# EAGLE design USB_Board (EAGLE 6.2)
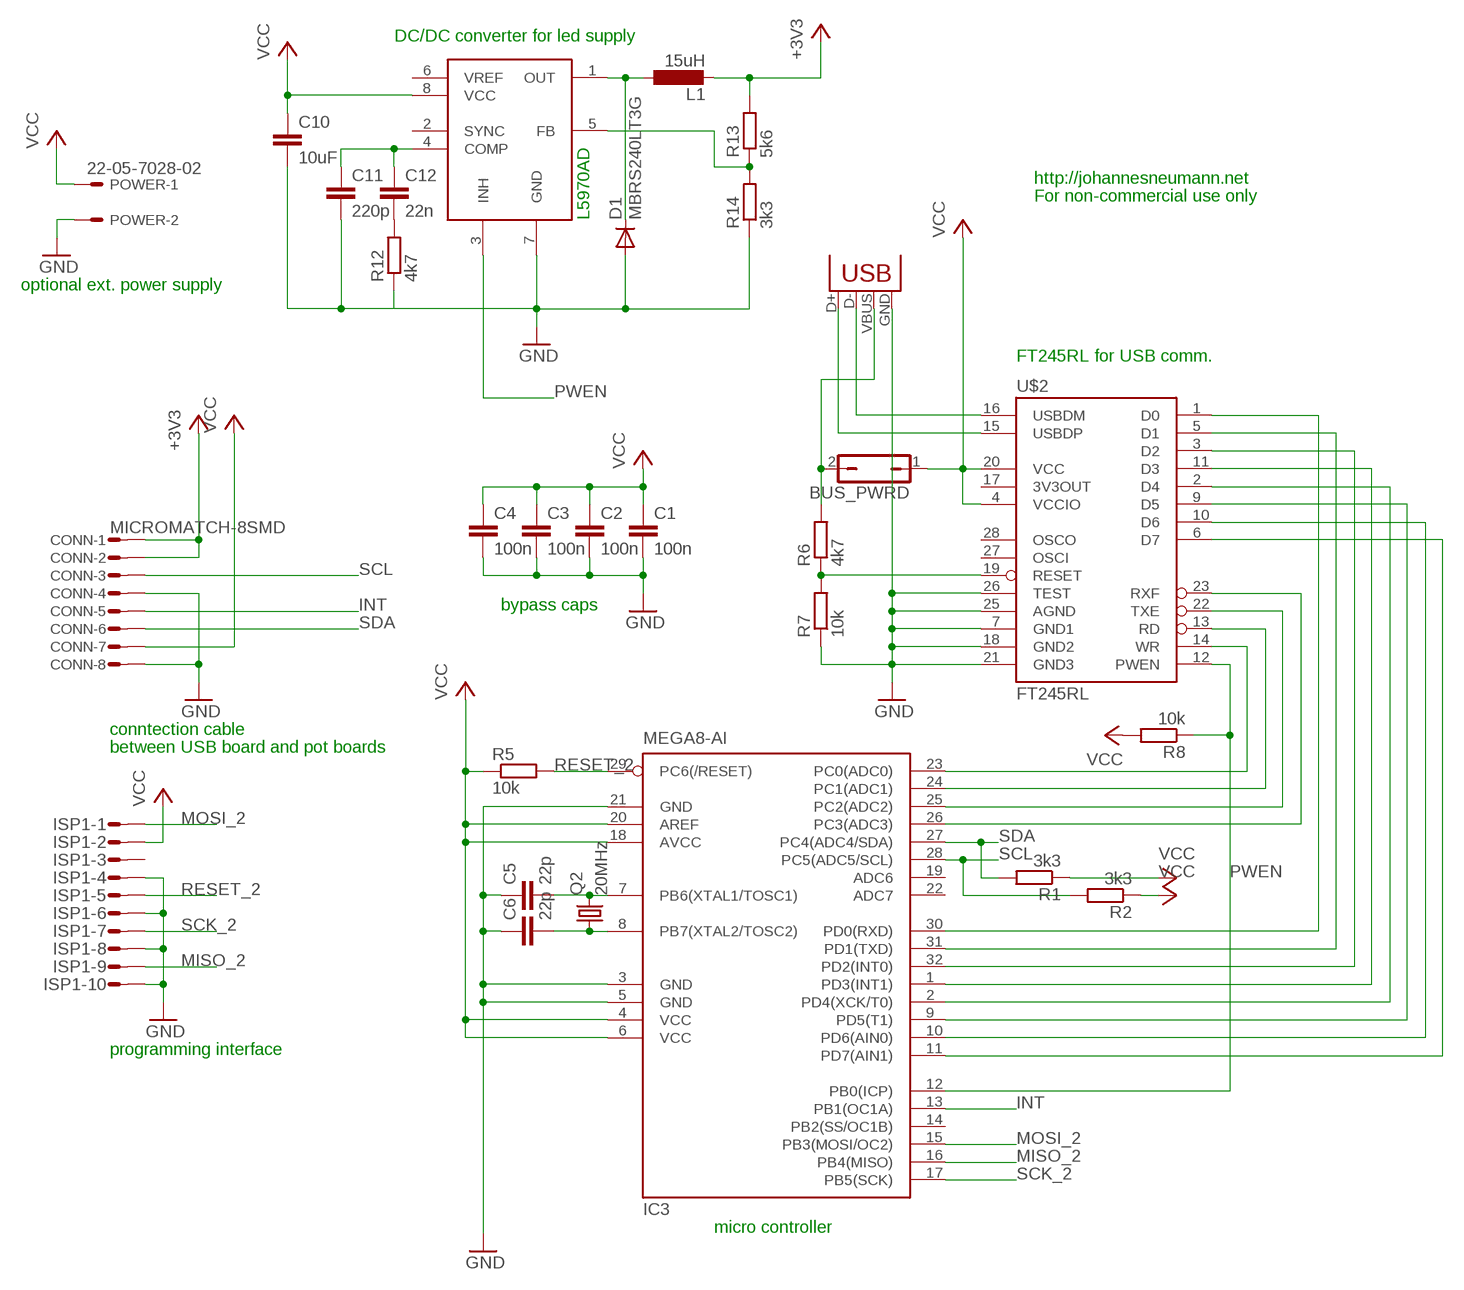
[diagram p0: schematic, sheet 1]

## Parts
BUS_PWRD  JP1Q  [JP1]
C1  100n  C-EUC0603  [C0603]
C2  100n  C-EUC0603  [C0603]
C3  100n  C-EUC0603  [C0603]
C4  100n  C-EUC0603  [C0603]
C5  22p  C-EUC0603  [C0603]
C6  22p  C-EUC0603  [C0603]
C10  10uF  C-EUC0805  [C0805]
C11  220p  C-EUC0603  [C0603]
C12  22n  C-EUC0603  [C0603]
CONN  MICROMATCH-8SMD  [MICROMATCH-8-SMD]
D1  MBRS240LT3G  1N4004  [DO41-10]
IC3  MEGA8-AI  [TQFP32-08]
ISP1  MICROMATCH-10-SMD  [MICROMATCH-10-SMD]
L1  15uH  L-EUPIS2816  [PIS2816]
POWER  22-05-7028-02  [7395-02]
Q2  20MHz  CRYSTALSM49  [SM49]
R1  3k3  R-EU_R0603  [R0603]
R2  3k3  R-EU_R0603  [R0603]
R5  10k  R-EU_R0603  [R0603]
R6  4k7  R-EU_R0603  [R0603]
R7  10k  R-EU_R0603  [R0603]
R8  10k  R-EU_R0603  [R0603]
R12  4k7  R-EU_R0603  [R0603]
R13  5k6  R-EU_R0603  [R0603]
R14  3k3  R-EU_R0603  [R0603]
U$2  FT245RL  [SSOP28DB]
U$3  L5970AD  [SO8]
X1  USBPTH  [USB-B-PTH]

## Nets
+3V3: CONN.1 CONN.2 L1.2 R13.2
GND: C1.2 C2.2 C3.2 C4.2 C5.1 C6.1 C10.2 C11.2 CONN.4 CONN.8 D1.A IC3.3(GND) IC3.5(GND) IC3.21(GND) ISP1.P$4 ISP1.P$6 ISP1.P$8 ISP1.P$10 POWER.2 R7.1 R12.1 R14.1 U$2.7(GND1) U$2.18(GND2) U$2.21(GND3) U$2.25(AGND) U$2.26(TEST) U$3.7(GND) X1.GND
INT: CONN.5 IC3.13(PB1(OC1A))
MISO_2: IC3.16(PB4(MISO)) ISP1.P$9
MOSI_2: IC3.15(PB3(MOSI/OC2)) ISP1.P$1
N$3: C5.2 IC3.7(PB6(XTAL1/TOSC1)) Q2.2
N$4: C6.2 IC3.8(PB7(XTAL2/TOSC2)) Q2.1
N$5: U$2.16(USBDM) X1.D-
N$7: IC3.30(PD0(RXD)) U$2.1(D0)
N$8: IC3.31(PD1(TXD)) U$2.5(D1)
N$9: IC3.32(PD2(INT0)) U$2.3(D2)
N$10: IC3.1(PD3(INT1)) U$2.11(D3)
N$11: IC3.2(PD4(XCK/T0)) U$2.2(D4)
N$12: IC3.9(PD5(T1)) U$2.9(D5)
N$13: IC3.10(PD6(AIN0)) U$2.10(D6)
N$14: IC3.11(PD7(AIN1)) U$2.6(D7)
N$15: IC3.26(PC3(ADC3)) U$2.23(RXF)
N$16: IC3.25(PC2(ADC2)) U$2.22(TXE)
N$17: IC3.24(PC1(ADC1)) U$2.13(RD)
N$18: IC3.23(PC0(ADC0)) U$2.14(WR)
N$19: D1.C L1.1 U$3.1(OUT)
N$21: BUS_PWRD.2 R6.2 X1.VBUS
N$29: R13.1 R14.2 U$3.5(FB)
N$33: C12.2 R12.2
N$34: C11.1 C12.1 U$3.4(COMP)
PWEN: IC3.12(PB0(ICP)) R8.1 U$2.12(PWEN) U$3.3(INH)
PWR_ON: R6.1 R7.2 U$2.19(RESET)
RESET_2: IC3.29(PC6(/RESET)) ISP1.P$5 R5.2
SCK_2: IC3.17(PB5(SCK)) ISP1.P$7
SCL: CONN.3 IC3.28(PC5(ADC5/SCL)) R2.2
SDA: CONN.6 IC3.27(PC4(ADC4/SDA)) R1.2
USB: U$2.15(USBDP) X1.D+
VCC: BUS_PWRD.1 C1.1 C2.1 C3.1 C4.1 C10.1 CONN.7 IC3.4(VCC) IC3.6(VCC) IC3.18(AVCC) IC3.20(AREF) ISP1.P$2 POWER.1 R1.1 R2.1 R5.1 R8.2 U$2.4(VCCIO) U$2.20(VCC) U$3.8(VCC)
Unconnected: IC3.14(PB2(SS/OC1B)) IC3.19(ADC6) IC3.22(ADC7) ISP1.P$3 U$2.17(3V3OUT) U$2.27(OSCI) U$2.28(OSCO) U$3.2(SYNC) U$3.6(VREF)

## Notes on the sheet
- DC/DC converter for led supply
- http://johannesneumann.net
- For non-commercial use only
- L5970AD
- optional ext. power supply
- FT245RL for USB comm.
- bypass caps
- conntection cable
- between USB board and pot boards
- programming interface
- micro controller

## Library data of the parts
BUS_PWRD = jumper:JP1Q: JUMPER
C1-C6 C10-C12 = rcl:C-EU: CAPACITOR, European symbol
CONN = con-amp-micromatch-2:MICROMATCH-8: MicroMaTch 8 7-215464-8 / 0-215464-8 Drawing Number C-215464 DDEController.pdf
D1 = diode:1N4004: DIODE general purpose rectifier, 1 A
IC3 = atmel:MEGA8: MICROCONTROLLER 8 Kbytes FLASH, 1 kbytes SRAM, 512 bytes EEPROM, USART, 6-channel 10 bit ADC, 2-channel 8 bit ADC Pin compatible with Atmega48, ATMega88, ATMega168 Source: avr.lbr
ISP1 = con-amp-micromatch:MICROMATCH-10-SMD
L1 = rcl:L-EU: INDUCTOR, European symbol
POWER = con-molex:22-?-02: CONNECTOR wire to board 2.54 mm (.1 inch) pitch header
Q2 = crystal:CRYSTAL: CRYSTAL
R1 R2 R5-R8 R12-R14 = rcl:R-EU_: RESISTOR, European symbol
U$2 = SparkFun:FT245RL: USB FIFO Controller 4th Generation USB Controller (USB <-> Parallel) - FIFO. Spark Fun Electronics SKU : COM-00787
U$3 = johannes:L5970AD
X1 = SparkFun:USB: USB Connectors USB-B-PTH is fully proven SKU : PRT-00139 USB-miniB is fully proven SKU : PRT-00587 USB-A-PCB is untested. USB-A-H is throughly reviewed, but untested. Spark Fun Electronics SKU : PRT-00437 USB-B-SMT is throughly reviewed, but untested. Needs silkscreen touching up. USB-A-S has not been used/tested USB-MB-H has not been used/tested

## Board
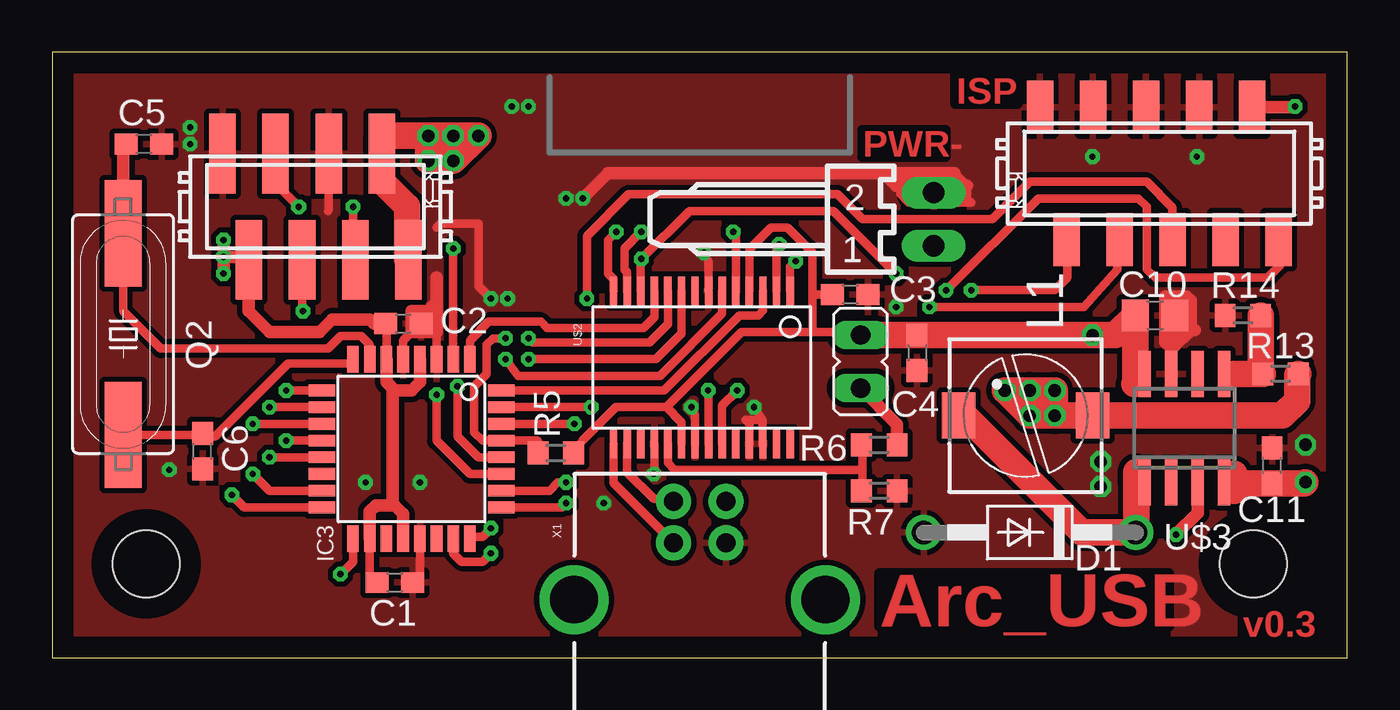
[diagram p1: board, top side]
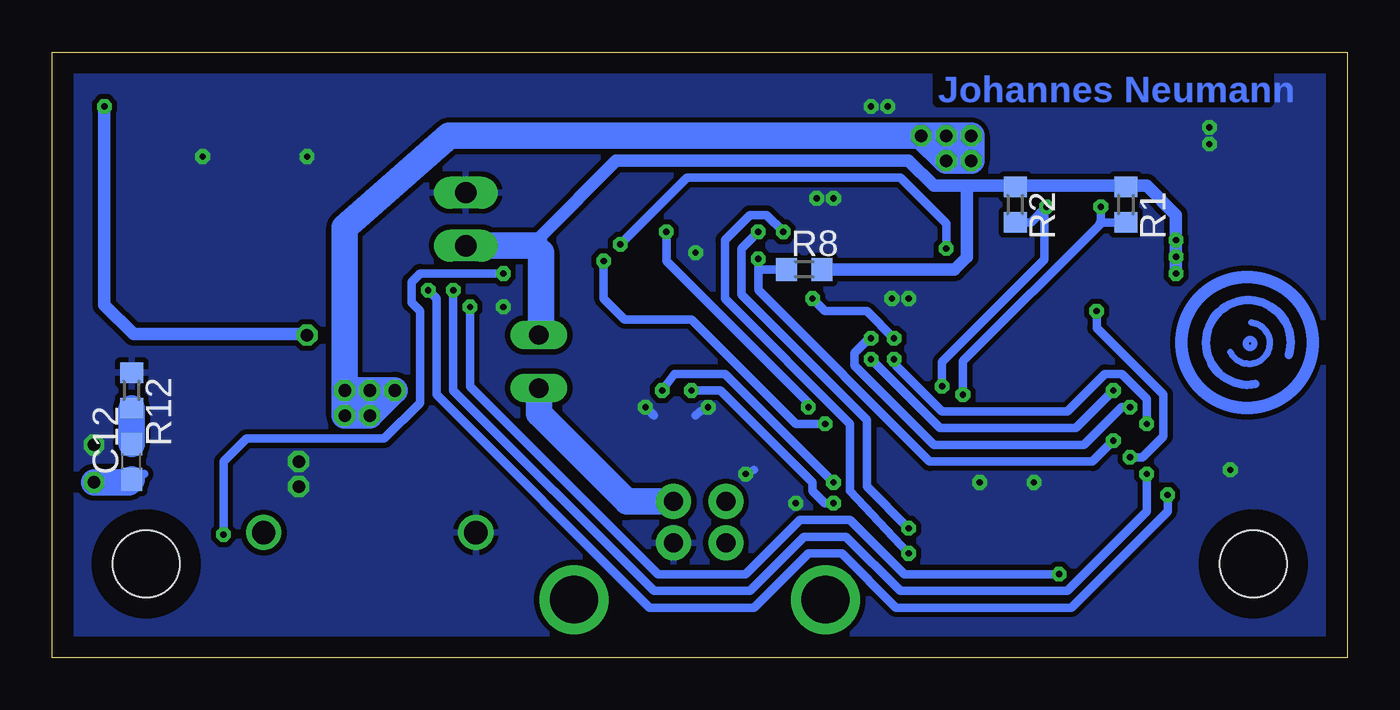
[diagram p2: board, bottom side, seen from below]

Size 62 x 29 mm. Coordinates in mm from the lower left corner, seen from the top.
Outline: 0,0 62,0 62,29 0,29 0,0
Copper layers (1*16): Top 0.035mm / dielectric 1.5mm / Bottom 0.035mm
Design rules: minimum track width 0.2mm, minimum drill 0.3mm, track to track 0.2mm, track to pad 0.2mm, pad to pad 0.2mm, via to via 0.2mm, smd to smd 0.15mm, copper to edge 40mil, drill to drill 8mil, minimum pad ring 0.2mm, minimum via ring 0.2mm, stop-mask expansion 0.15mm, vias tented up to drill 0.6mm, thermal gap 10mil
Holes 3.2 mm at 4.5,4.5 57.5,4.5

### Footprints (pad centres in the part's own frame; a part is rotated, then mirrored left to right if it is on the bottom)
JP1 = drill 0.914 long: 1 0,-1.27; 2 0,1.27
C0603 = smd 1.1 x 1: 1 -0.85,0; 2 0.85,0
C0805 = smd 1.3 x 1.5: 1 -0.95,0; 2 0.95,0
MICROMATCH-8-SMD = smd 1.27 x 3.81: 1 4.445,-2.54; 2 3.175,2.54; 3 1.905,-2.54; 4 0.635,2.54; 5 -0.635,-2.54; 6 -1.905,2.54; 7 -3.175,-2.54; 8 -4.445,2.54
DO41-10 = drill 1.118: A 5.08,0; C -5.08,0
TQFP32-08 = smd 1.27 x 0.559: 1 -4.293,2.8; 2 -4.293,2; 3 -4.293,1.2; 4 -4.293,0.4; 5 -4.293,-0.4; 6 -4.293,-1.2; 7 -4.293,-2; 8 -4.293,-2.8; 17 4.293,-2.8; 18 4.293,-2; 19 4.293,-1.2; 20 4.293,-0.4; 21 4.293,0.4; 22 4.293,1.2; 23 4.293,2; 24 4.293,2.8 | smd 0.559 x 1.27: 9 -2.8,-4.293; 10 -2,-4.293; 11 -1.2,-4.293; 12 -0.4,-4.293; 13 0.4,-4.293; 14 1.2,-4.293; 15 2,-4.293; 16 2.8,-4.293; 25 2.8,4.293; 26 2,4.293; 27 1.2,4.293; 28 0.4,4.293; 29 -0.4,4.293; 30 -1.2,4.293; 31 -2,4.293; 32 -2.8,4.293
MICROMATCH-10-SMD = smd 1.27 x 2.54: P$1 -5.715,3.175; P$2 -4.445,-3.175; P$3 -3.175,3.175; P$4 -1.905,-3.175; P$5 -0.635,3.175; P$6 0.635,-3.175; P$7 1.905,3.175; P$8 3.175,-3.175; P$9 4.445,3.175; P$10 5.715,-3.175
PIS2816 = smd 2.2 x 1.6: 1 0,3.2; 2 0,-3.2
7395-02 = drill 1.016 long: 1 1.27,0; 2 -1.27,0
SM49 = smd 5.08 x 1.778: 1 -4.826,0; 2 4.826,0
R0603 = smd 1 x 1.1: 1 -0.85,0; 2 0.85,0
SSOP28DB = smd 0.348 x 1.397: 1 -4.225,-3.656; 2 -3.575,-3.656; 3 -2.925,-3.656; 4 -2.275,-3.656; 5 -1.625,-3.656; 6 -0.975,-3.656; 7 -0.325,-3.656; 8 0.325,-3.656; 9 0.975,-3.656; 10 1.625,-3.656; 11 2.275,-3.656; 12 2.925,-3.656; 13 3.575,-3.656; 14 4.225,-3.656; 15 4.225,3.656; 16 3.575,3.656; 17 2.925,3.656; 18 2.275,3.656; 19 1.625,3.656; 20 0.975,3.656; 21 0.325,3.656; 22 -0.325,3.656; 23 -0.975,3.656; 24 -1.625,3.656; 25 -2.275,3.656; 26 -2.925,3.656; 27 -3.575,3.656; 28 -4.225,3.656
SO8 = smd 0.6 x 2.2: 1 -1.905,-2.6; 2 -0.635,-2.6; 3 0.635,-2.6; 4 1.905,-2.6; 5 1.905,2.6; 6 0.635,2.6; 7 -0.635,2.6; 8 -1.905,2.6
USB-B-PTH = drill 0.914 pad 1.676: D+ 0,1.25; D- 1.981,1.25; GND 0,-1.25; VBUS 1.981,-1.25 | drill 2.286: S1 -2.718,-6.02; S2 -2.718,6.02

### Placement (x,y rotation side)
BUS_PWRD  38.7,14.18 180 top
C1  16.4,3.6 0 top
C2  16.8,16 0 top
C3  38.2,17.4 0 top
C4  41.4,14.6 270 top
C5  4.4,24.6 180 top
C6  7.2,9.9 90 top
C10  52.8,16.4 0 top
C11  58.4,9.2 90 top
C12  58.2,9.4 90 bottom
CONN  12.6,21.6 0 top
D1  46.8,6 180 top
IC3  17.2,10 270 top
ISP1  53,23.2 180 top
L1  46.6,11.6 90 top
POWER  42.2,21 270 top
Q2  3.4,15.5 90 top
R1  10.6,21.7 270 bottom
R2  15.9,21.7 270 bottom
R5  24.1,9.8 180 top
R6  39.6,10.2 0 top
R7  39.6,8 180 top
R8  26,18.6 0 bottom
R12  58.2,12.8 270 bottom
R13  58.8,13.6 0 top
R14  57,16.4 0 top
U$2  31.1,13.9 180 top
U$3  54.2,11 0 top
X1  31,5.5 90 top

### Tracks (layer width: path | path; a pad name or v marks a point on that pad's centre or on a via)
+3V3  (via drill 0.6)
  Top 1.27: R13.2 59.6,13.55 59.6,12.3 58.9,11.6 L1.2 v46.8,11.6 v45.6,12.8 v46.8,12.8 v48,12.8 v48,11.6 | CONN.1 17,19.11 17,21.6 15.78,22.82 CONN.2 15.78,24.98 15.8,25 v18,25 | v18,25 v19.2,25 v20.4,25 v19.2,23.8 v18,23.8 v18,25
  Bottom 1.27: v48,12.8 v48,11.6 v46.8,11.6 v45.6,12.8 v48,12.8 | 18,24.4 v18,23.8 v19.2,23.8 v20.4,25 | v20.4,25 43,25 48,20.6 v48,12.8 | v20.4,25 v19.2,25 v18,25 18,24.6
GND  (via drill 0.3, 0.6)
  Top 0.406: U$2.7 31.43,18.98 31.4,19 | CONN.4 13.23,21.43 13.2,21.4 | IC3.5 16.8,15.2 17.2,15.6 17.6,15.6 | 17.6,15.6 18.2,15.6 18.4,15.4 IC3.3 | C2.2 17.65,15.65 17.6,15.6 | U$2.18 28.82,9.03 v28.8,8.8 | U$2.21 30.77,11.62 v30.6,12 | U$2.25 33.38,11.22 33.2,11.4 34,11.4 | 34,11.4 34,10.2 | 34,11.4 v33.6,12 | IC3.21 17.6,3.95 C1.2 | 18.4,20.6 18.6,20.8 20.4,20.8 20.4,17.8 v21,17.2 | 43.2,23.2 43.8,22.6 43.8,22 44,21.8 41,21.8 40.6,22.2 40.6,22.6 41,23 42.6,23 42.6,22.6
  Top 0.61: U$3.7 53.56,16.21 C10.2 53.75,16.35 54.3,15.8 | 54.7,15.7 54.5,15.7 53.7,14.9 53.7,15.2 54.3,15.8 | 54.3,15.8 54.5,16 54.5,17.1 54.3,17.3 53.3,17.3 53.3,15.1 53.5,14.9 | C2.2 17.65,16.25 | 18.4,17 18.4,15.6 18.2,15.6 17.2,15.6 17.2,16.6 17.8,16.6 17.8,16.4 18.4,17 | 18.4,18.2 18.4,17 | 43.13,23.2 40,23.2 | 43.2,23.2 43.13,23.2 | 43.13,23.2 POWER.2 | 40,23.2 39.8,23.2 | 39.8,23.2 26.6,23.2 v25.4,22 | 40.6,22.6 40,23.2 | 43.8,22.6 40.4,22.6 39.8,23.2
  Bottom 0.406: v28.8,8.8 28.4,9 | v30.6,12 31,11.8 31.2,11.6 | v33.6,12 33.2,11.6
  other vias: 60,10.2 50.2,9.4 50.2,8.2 31.2,19.4 24.6,22 21.8,17.2 40.4,16.8 22,26.4 22.8,26.4 49.8,24 54.8,24 6.6,25.4 6.6,24.6 5.6,9 15,8.4 17.6,8.4 26.4,7.4
  pour Top (isolate 0.254): 0,0 62,0 62,29 0,29
  pour Bottom (isolate 0.254): 0,29 62,29 62,-0.4 0,-0.4
INT  (via drill 0.3)
  Top 0.406: IC3.13 v10.4,9.6 | CONN.5 11.96,16.43 v12,16.6
  Bottom 0.406: v10.4,9.6 9.8,9.6 8.8,10.6 8.8,12.6 12,15.8 v12,16.6
MISO_2  (via drill 0.3)
  Top 0.406: IC3.16 9.2,7.2 v8.6,7.8 | v44,17.6 48,17.6 48.6,18.2 48.6,19.98 ISP1.P$9
  Bottom 0.406: v8.6,7.8 8.6,7 13.2,2.4 21.6,2.4 24.2,5 25.8,5 28.4,2.4 33.4,2.4 43.6,12.6 43.6,17.2 v44,17.6
MOSI_2  (via drill 0.3)
  Top 0.406: IC3.15 10.4,8 v9.6,8.8 | v42.8,17.6 47.2,22 52,22 52.4,21.6 52.4,18.6 52.8,18.2 58.2,18.2 58.8,18.8 58.8,19.94 ISP1.P$1 58.8,20.11
  Bottom 0.406: v9.6,8.8 9.6,7 13.4,3.2 21.4,3.2 24,5.8 26,5.8 28.6,3.2 33.2,3.2 42.8,12.8 v42.8,17.6
N$3
  Top 0.406: IC3.7 15.2,15 14.8,15.4 13.8,15.4 13.2,14.8 5.2,14.8 3.4,16.6 Q2.2
  Top 0.61: C5.2 3.4,24.55 Q2.2 3.3,20.23
N$4
  Top 0.406: Q2.1 7.12,10.67 | C6.2 7.35,10.6 7.8,10.6 11.29,14.09 14.2,14.09 IC3.8
  Top 0.61: 7.12,10.67 C6.2
N$5
  Top 0.406: U$2.16 27.52,8.88 28.8,7.6 29.63,7.6 X1.D-
N$7  (via drill 0.3)
  Top 0.406: IC3.30 v25,11.2 | 35.4,18.8 v35.6,19 35.33,18.73 U$2.1
  Bottom 0.406: v25,11.2 26.4,11.2 31.4,16.2 34.6,16.2 35.6,17.2 v35.6,19
N$8  (via drill 0.3)
  Top 0.406: IC3.31 v25.8,12 | U$2.5 32.73,20.27 v32.6,20.4
  Bottom 0.406: v25.8,12 25.8,12.2 32.6,19 v32.6,20.4
N$9
  Top 0.406: IC3.32 29.3,12.8 32.9,16.4 33.8,16.4 34.02,16.62 U$2.3
N$10
  Top 0.406: U$2.11 28.82,16.32 28.3,15.8 23.7,15.8 23.4,16.1 20.9,16.1 20,15.2 IC3.1
N$11  (via drill 0.3)
  Top 0.406: U$2.2 34.67,19.68 v34.8,19.8 | v19.2,19.6 IC3.2
  Bottom 0.406: v34.8,19.8 31.6,23 21.4,23 19.2,20.8 v19.2,19.6
N$12  (via drill 0.3)
  Top 0.406: U$2.9 30.12,15.53 28.9,14.3 v22.8,14.3 | v11.2,12.8 IC3.9
  Bottom 0.406: v11.2,12.8 13,11 19.5,11 v22.8,14.3
N$13  (via drill 0.3)
  Top 0.406: U$2.10 29.48,15.97 28.6,15.1 23,15.1 v22.8,15.3 | v10.4,12 IC3.10
  Bottom 0.406: v22.8,15.3 22.9,15.3 23.6,14.6 23.6,14 19.8,10.2 12.6,10.2 10.8,12 v10.4,12
N$14  (via drill 0.3)
  Top 0.406: U$2.6 32.08,16.48 29.1,13.5 22.3,13.5 v21.7,14.3 | IC3.11 v9.6,11.2
  Bottom 0.406: v9.6,11.2 9.6,12.4 10.8,13.6 11.6,13.6 13.4,11.8 19.4,11.8 21.6,14 21.6,14.2 v21.7,14.3
N$15  (via drill 0.3)
  Top 0.406: U$2.23 32.08,12.07 v32.8,12.8 | IC3.26 23.8,8 24.2,8.4 v24.6,8.4
  Bottom 0.406: v24.6,8.4 29.8,13.6 32.2,13.6 v32.8,12.8
N$16  (via drill 0.3)
  Top 0.406: U$2.22 31.43,12.62 v31.4,12.8 | IC3.25 24.4,7.2 v24.6,7.4
  Bottom 0.406: v31.4,12.8 30,12.8 25.6,8.4 25.6,8 25,7.4 v24.6,7.4
N$17  (via drill 0.3)
  Top 0.406: v28.2,20.4 27.4,19.6 27.4,18.6 27.52,18.48 U$2.13 | v21,6.2 20.6,5.8 20.09,5.8 IC3.24
  Bottom 0.406: v28.2,20.4 29,19.6 29,17.4 23,11.4 23,8.2 v21,6.2
N$18  (via drill 0.3)
  Top 0.406: 26.88,20.32 v27,20.4 26.6,20 26.6,18.4 26.88,18.12 U$2.14 | IC3.23 19.2,5 19.6,4.6 20.6,4.6 v21,5
  Bottom 0.406: v27,20.4 27.8,21.2 28.6,21.2 29.8,20 29.8,17.2 23.8,11.2 23.8,8 v21,5
N$19
  Top 0.406: U$3.1 51.9,8.4
  Top 1.27: L1.1 43.7,11.6 49.3,6 D1.C 51.9,6 51.9,8.4 51.9,8.9
N$21
  Top 0.61: R6.2 40.45,11.16 BUS_PWRD.2
  Bottom 1.27: X1.VBUS 34.48,7.48 38.7,11.7 BUS_PWRD.2
N$24
  Bottom 0.406: 4.4,13.1 arc297 2.8,14.5
N$25
  Bottom 0.305: 5.6,14.65 arc-239 4.6,16.05
N$29
  Top 0.406: 56.6,13.6 U$3.5
  Top 1.27: R14.2 57.85,13.7 R13.1 56.6,13.6
N$33
  Bottom 1.27: R12.2 C12.2
N$34  (via drill 0.6)
  Top 0.406: 56.6,8.8 56.51,8.8 U$3.4
  Top 1.27: 56.6,8.8 56.6,8.2 | 56.6,8 56.6,8.2 | 56.6,8.2 56.75,8.35 C11.1 59.95,8.35 v60,8.4
  Bottom 0.406: C12.1 57.6,8.8
  Bottom 1.27: C12.1 58.35,8.4 v60,8.4
PWEN  (via drill 0.3)
  Top 0.406: U$2.12 28.18,18.77 v28.2,19.1 30.5,21.4 37.4,21.4 v40.4,18.4 | v11.2,10.4 IC3.12
  Top 0.61: U$3.3 54.84,6.93 v53.8,5.9
  Bottom 0.406: v53.8,5.9 53.8,9.4 52.7,10.5 46.1,10.5 44.4,12.2 44.4,16.6 44.8,17 44.8,18 44.4,18.4 v40.4,18.4 | v28.2,19.1 28.2,18.6 | 28.2,18.6 28.2,17.6 20,9.4 12.2,9.4 v11.2,10.4 | R8.1 28.2,18.6
PWR_ON
  Top 0.406: U$2.19 29.48,9.32 29.8,9 38.8,9 | 38.8,9 38.8,10.15 R6.1 | 38.8,9 38.8,8.05 R7.2
RESET_2  (via drill 0.3)
  Top 0.406: IC3.29 23,10.4 23.2,10.2 R5.2 23.25,10.35 23.2,10.4 20.6,10.4 20.2,10.8 20.2,13 20.8,13.6 20.8,15 21.1,15.3 v21.7,15.3 | ISP1.P$5 53.63,21.57 52.4,22.8 46.8,22.8 45,21 38.8,21 37.6,22.2 27.6,22.2 25.6,20.2 v25.6,17.2
  Bottom 0.406: v21.7,15.3 23,16.6 25,16.6 v25.6,17.2
SCK_2  (via drill 0.3)
  Top 0.406: IC3.17 14.4,4.6 v13.8,4 | v42,16.8 49.4,16.8 51,18.6 51,19.93 ISP1.P$7
  Bottom 0.406: v13.8,4 21.2,4 23.8,6.6 26.2,6.6 28.8,4 33,4 42,13 v42,16.8
SCL  (via drill 0.3)
  Top 0.406: v19.4,13 19.4,10.6 20.4,9.6 IC3.28 | v14.4,21.6 14.4,19.16 CONN.3
  Bottom 0.406: v19.4,13 19.4,14.16 CONN.3 14.51,21.5 v14.4,21.6 15.15,20.85 R2.2
SDA  (via drill 0.3)
  Top 0.406: CONN.6 10.8,24.04 10.8,22.6 v11.8,21.6 | v18.4,12.6 18.4,10.4 20,8.8 IC3.27
  Bottom 0.406: v11.8,21.6 11.8,20.8 | 11.8,20.8 18.4,14.2 v18.4,12.6 | R1.2 11.85,20.85 11.8,20.8
USB
  Top 0.406: U$2.15 26.88,8.38 X1.D+
VCC  (via drill 0.3, 0.6)
  Top 0.406: 51.8,13.1 51.8,13.11 U$3.8 | 29.4,12 33,15.6 36.4,15.6 | 36.4,15.6 39.05,15.6 39.2,15.45 | IC3.6 16,15.95 C2.1 | R5.1 25.4,10.4 27,12 29.4,12 | U$2.20 30.12,11.28 29.4,12 | IC3.18 15.2,3.95 C1.1 | U$2.4 33.38,19.57 34.4,20.6 35.2,20.6 36.4,19.4 36.4,17.4 | 36.4,17.4 36.4,15.6 | C3.1 36.4,17.4
  Top 0.61: ISP1.P$2 59.48,26.38 v59.5,26.4 | 16.2,7.3 16.4,7.3 16.8,6.9 IC3.20 | IC3.6 16,13.2 16.4,12.8 | 16.4,12.8 17.2,12.8 17.6,13.2 IC3.4 | IC3.18 15.2,7 15.5,7.3 16.2,7.3 | 16.2,7.3 16.3,7.4 16.3,12.7 16.4,12.8 | C2.1 15.4,16 15.2,16.2 13.4,16.2 12.8,15.6 10.4,15.6 9.4,16.6 9.4,19.04 CONN.7 9.29,19.2 v8.2,19.2 | v8.2,19.2 v8.2,18.4 | v8.2,20 v8.2,19.2
  Top 1.27: BUS_PWRD.1 39.2,15.45 C4.1 v49.8,15.45 50.9,15.45 C10.1 51.85,13.15 51.8,13.1
  Bottom 0.406: R2.1 15.9,22.6 | 9.6,22.6 10.55,22.6 R1.1
  Bottom 0.61: v59.5,26.4 59.5,16.9 58.1,15.5 49.85,15.5 v49.8,15.45 | 38.76,15.5 BUS_PWRD.1 38.6,15.55 | v8.2,18.4 8.2,21.2 9.6,22.6 15.9,22.6 18,22.6 | 18,22.6 19.8,22.6 21,23.8 35,23.8 38.6,20.2 38.6,19.4 | R8.2 18.8,18.6 18.2,19.2 18.2,22.4 18,22.6
  Bottom 1.27: 38.6,15.55 38.6,19.4 38.93,19.73 POWER.1
(copper drawn outside any net)
  shapes: Bottom circle x2

### Text on the board
Top: ISP | PWR- | Arc_USB | v0.3
Bottom: Johannes Neumann